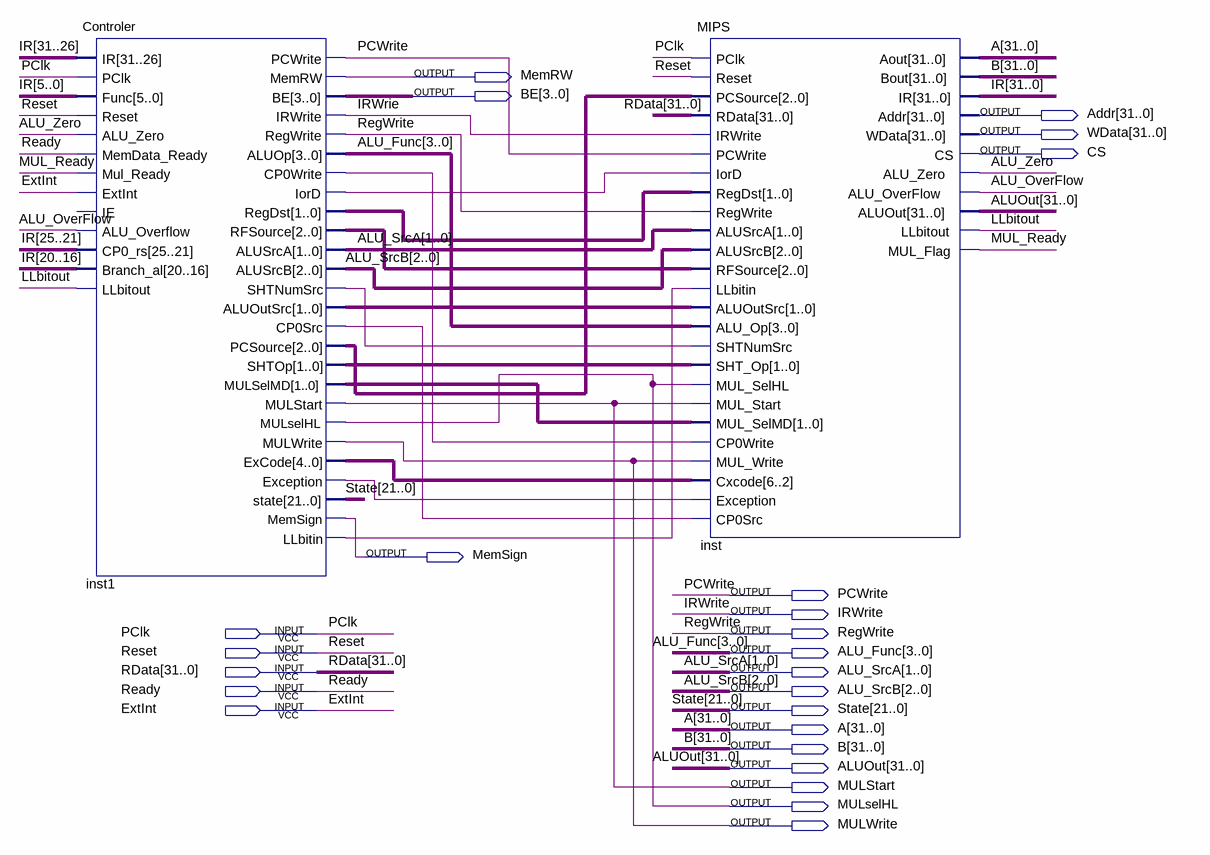
[diagram p0: schematic sheet]
// Quartus schematic MIPS-C.bdf as structural Verilog: 2 symbols, 24 pins
module \MIPS-C  (
  input  PClk,
  input  Reset,
  input  [31:0] RData,
  input  Ready,
  input  ExtInt,
  output MemRW,
  output [3:0] BE,
  output [31:0] Addr,
  output [31:0] WData,
  output CS,
  output MemSign,
  output PCWrite,
  output IRWrite,
  output RegWrite,
  output [3:0] ALU_Func,
  output [1:0] ALU_SrcA,
  output [2:0] ALU_SrcB,
  output [21:0] State,
  output [31:0] A,
  output [31:0] B,
  output [31:0] ALUOut,
  output MULStart,
  output MULselHL,
  output MULWrite
);

  wire ALU_OverFlow, ALU_Zero, inst1_cp0src, inst1_cp0write, inst1_exception, inst1_iord, inst1_llbitin,
       inst1_shtnumsrc, IRWrie, LLbitout, MUL_Ready;
  wire [1:0] inst1_aluoutsrc, inst1_mulselmd, inst1_regdst, inst1_shtop;
  wire [2:0] inst1_pcsource, inst1_rfsource;
  wire [4:0] inst1_excode;
  wire [31:0] IR;

  Controler inst1 (
    .IR(IR[31:26]), .PClk(PClk), .Func(IR[5:0]), .Reset(Reset), .ALU_Zero(ALU_Zero), .MemData_Ready(Ready),
    .Mul_Ready(MUL_Ready), .ExtInt(ExtInt), .ALU_Overflow(ALU_OverFlow), .CP0_rs(IR[25:21]),
    .Branch_al(IR[20:16]), .LLbitout(LLbitout), .PCWrite(PCWrite), .MemRW(MemRW), .BE(BE), .IRWrite(IRWrie),
    .RegWrite(RegWrite), .ALUOp(ALU_Func), .CP0Write(inst1_cp0write), .IorD(inst1_iord),
    .RegDst(inst1_regdst), .RFSource(inst1_rfsource), .ALUSrcA(ALU_SrcA), .ALUSrcB(ALU_SrcB),
    .SHTNumSrc(inst1_shtnumsrc), .ALUOutSrc(inst1_aluoutsrc), .CP0Src(inst1_cp0src),
    .PCSource(inst1_pcsource), .SHTOp(inst1_shtop), .MULSelMD(inst1_mulselmd), .MULStart(MULStart),
    .MULselHL(MULselHL), .MULWrite(MULWrite), .ExCode(inst1_excode), .Exception(inst1_exception),
    .state(State), .MemSign(MemSign), .LLbitin(inst1_llbitin));  // open: IE
  MIPS inst (
    .PClk(PClk), .Reset(Reset), .IorD(inst1_iord), .RData(RData), .IRWrite(IRWrie),
    .PCSource(inst1_pcsource), .ALUSrcA(ALU_SrcA), .RegDst(inst1_regdst), .PCWrite(PCWrite),
    .ALUOutSrc(inst1_aluoutsrc), .ALUSrcB(ALU_SrcB), .RegWrite(RegWrite), .RFSource(inst1_rfsource),
    .SHTNumSrc(inst1_shtnumsrc), .ALU_Op(ALU_Func), .LLbitin(inst1_llbitin), .CP0Src(inst1_cp0src),
    .SHT_Op(inst1_shtop), .MUL_SelHL(MULselHL), .MUL_Start(MULStart), .CP0Write(inst1_cp0write),
    .MUL_SelMD(inst1_mulselmd), .Cxcode(inst1_excode), .MUL_Write(MULWrite), .Exception(inst1_exception),
    .CS(CS), .Addr(Addr), .Aout(A), .IR(IR), .LLbitout(LLbitout), .ALU_Zero(ALU_Zero),
    .ALU_OverFlow(ALU_OverFlow), .ALUOut(ALUOut), .Bout(B), .MUL_Flag(MUL_Ready), .WData(WData));
endmodule
